# Altium schematic sheet eGAN-FET-module_Driver.SchDoc
size 594 x 420 mm; SheetNumber: 4; Format: A2
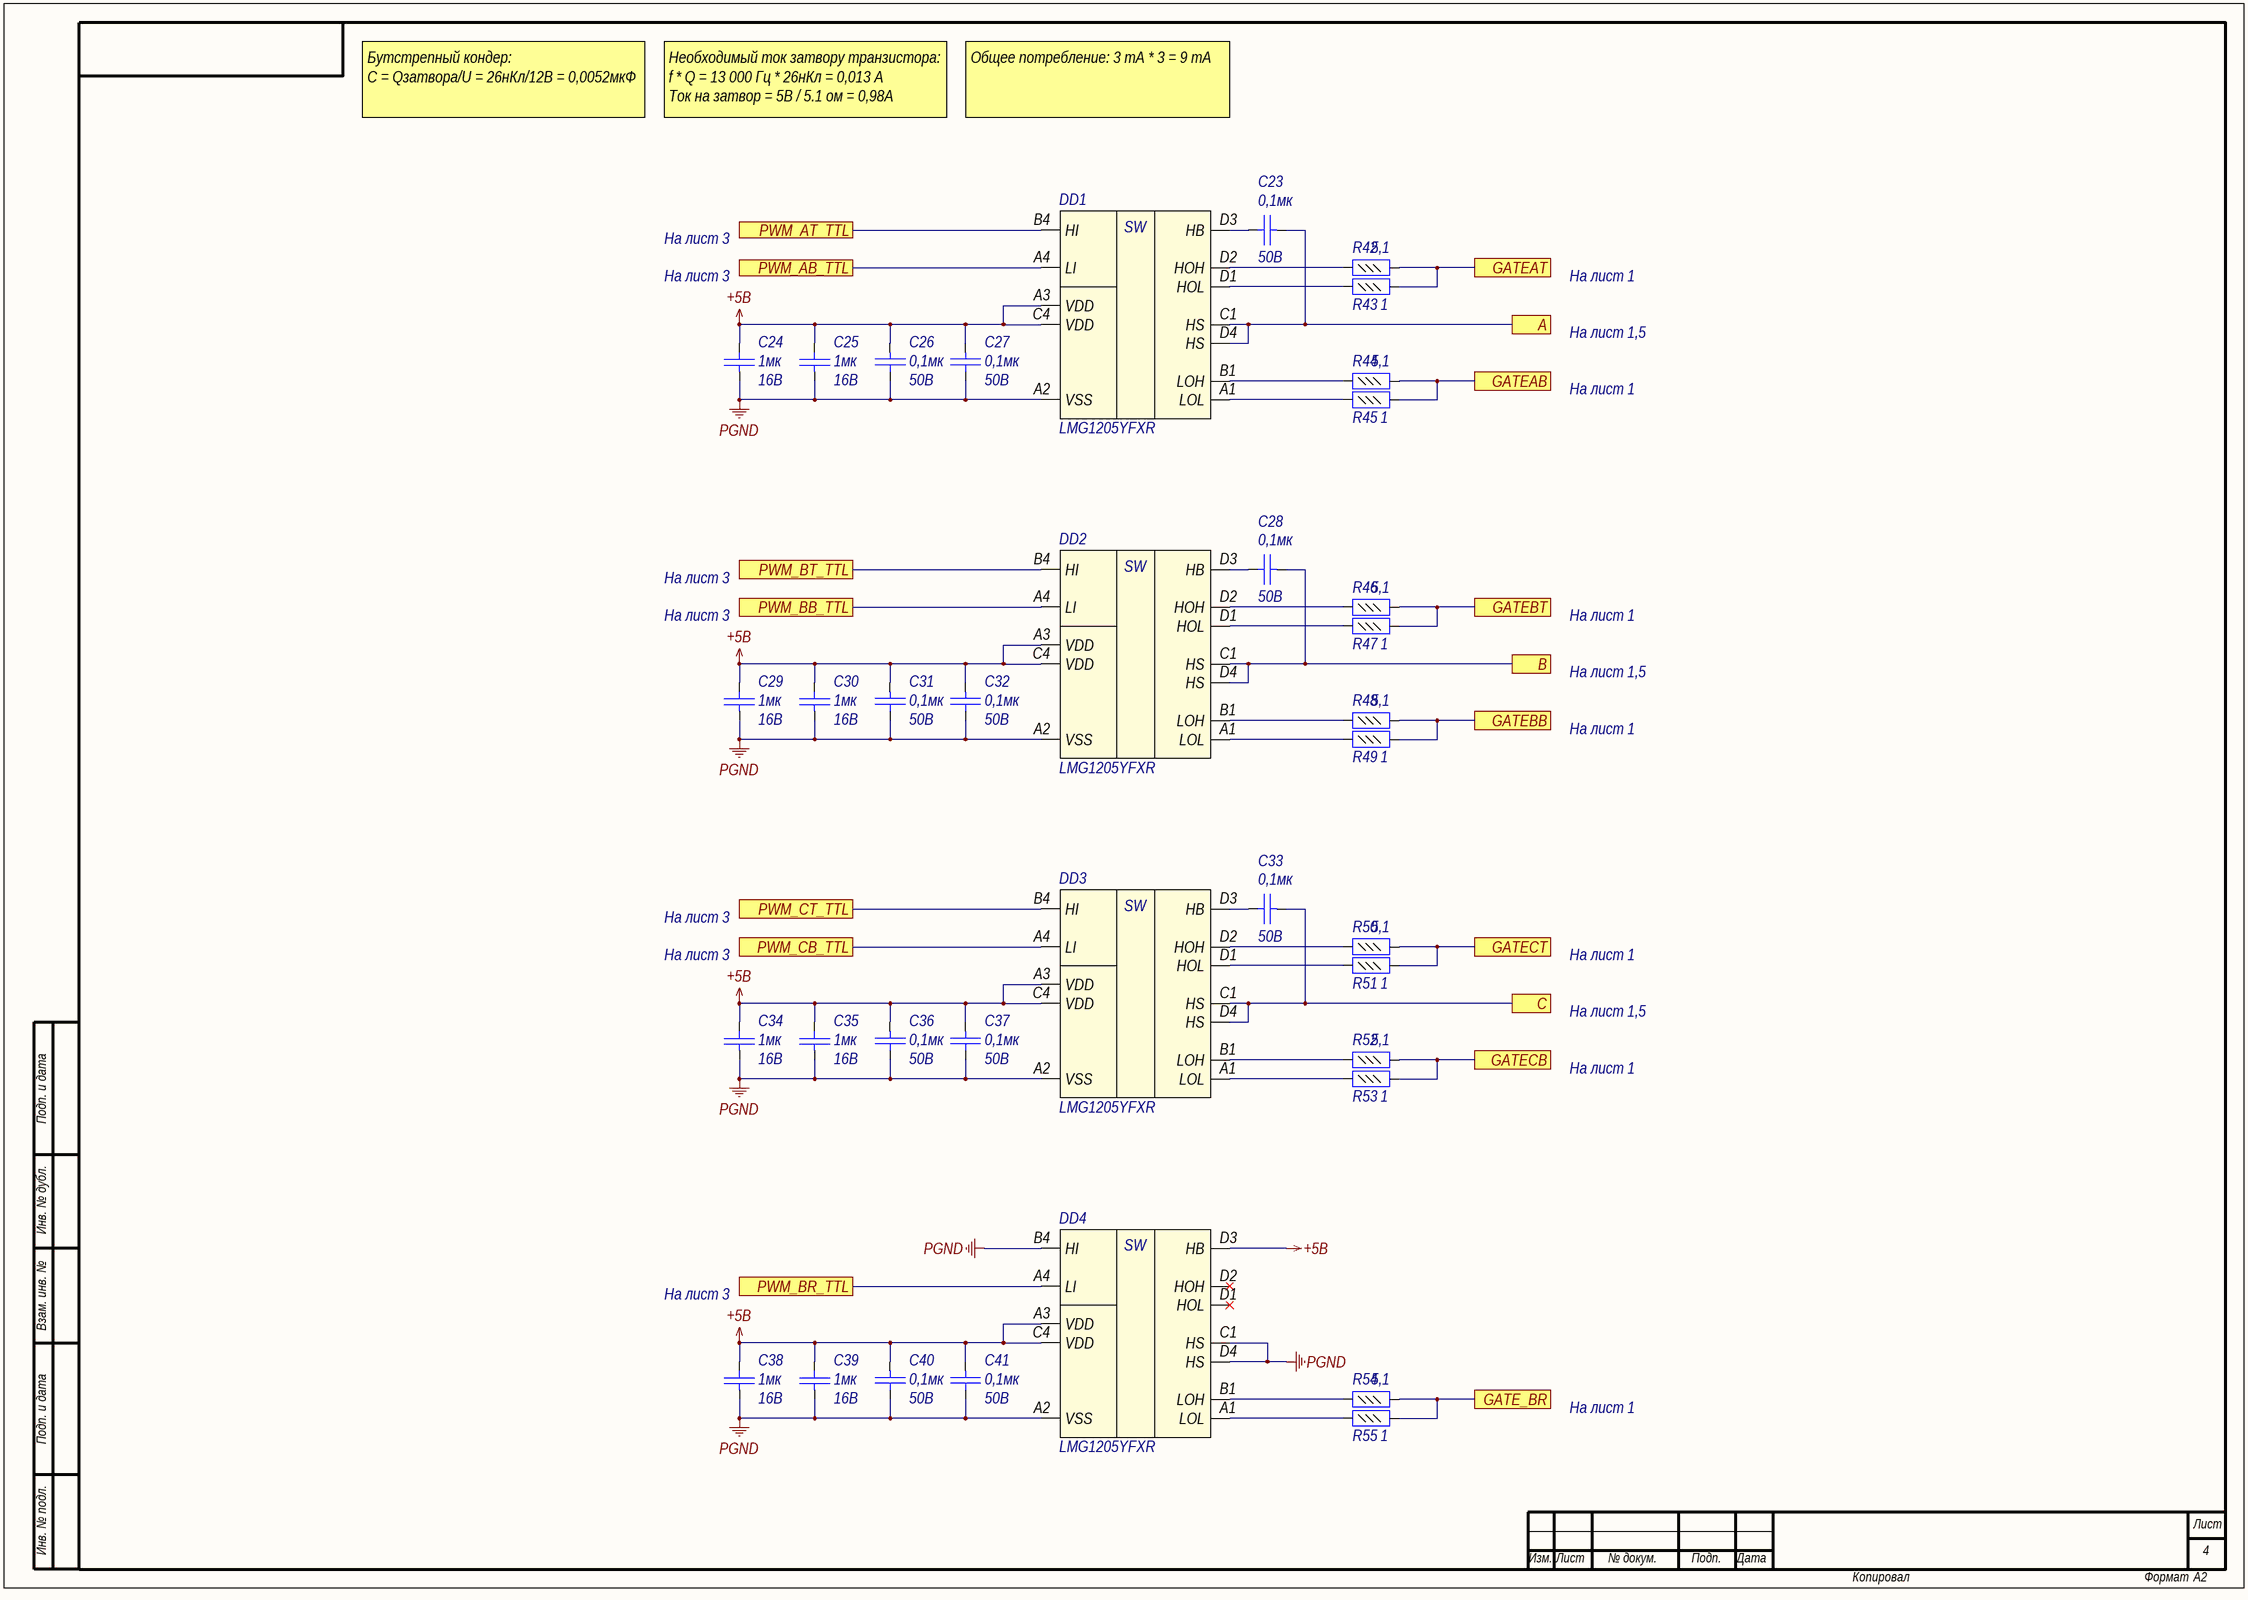
[diagram p0: eGAN-FET-module_Driver.SchDoc]

## Parts
C23  value 0,1мк  Voltage: 50В  [C0402]  (hidden comment: Capacitor)
C24  Voltage: 16B  [C0402]  (hidden comment: 1мк)
C25  Voltage: 16B  [C0402]  (hidden comment: 1мк)
C26  value 0,1мк  Voltage: 50В  [C0402]  (hidden comment: Capacitor)
C27  value 0,1мк  Voltage: 50В  [C0402]  (hidden comment: Capacitor)
C28  value 0,1мк  Voltage: 50В  [C0402]  (hidden comment: Capacitor)
C29  Voltage: 16B  [C0402]  (hidden comment: 1мк)
C30  Voltage: 16B  [C0402]  (hidden comment: 1мк)
C31  value 0,1мк  Voltage: 50В  [C0402]  (hidden comment: Capacitor)
C32  value 0,1мк  Voltage: 50В  [C0402]  (hidden comment: Capacitor)
C33  value 0,1мк  Voltage: 50В  [C0402]  (hidden comment: Capacitor)
C34  Voltage: 16B  [C0402]  (hidden comment: 1мк)
C35  Voltage: 16B  [C0402]  (hidden comment: 1мк)
C36  value 0,1мк  Voltage: 50В  [C0402]  (hidden comment: Capacitor)
C37  value 0,1мк  Voltage: 50В  [C0402]  (hidden comment: Capacitor)
C38  Voltage: 16B  [C0402]  (hidden comment: 1мк)
C39  Voltage: 16B  [C0402]  (hidden comment: 1мк)
C40  value 0,1мк  Voltage: 50В  [C0402]  (hidden comment: Capacitor)
C41  value 0,1мк  Voltage: 50В  [C0402]  (hidden comment: Capacitor)
DD1  LMG1205YFXR  [DSBGA12]
DD2  LMG1205YFXR  [DSBGA12]
DD3  LMG1205YFXR  [DSBGA12]
DD4  LMG1205YFXR  [DSBGA12]
R42  value 5,1  [R0402]  (hidden comment: Resistor_0,062Вт)
R43  value 1  [R0402]  (hidden comment: Resistor_0,062Вт)
R44  value 5,1  [R0402]  (hidden comment: Resistor_0,062Вт)
R45  value 1  [R0402]  (hidden comment: Resistor_0,062Вт)
R46  value 5,1  [R0402]  (hidden comment: Resistor_0,062Вт)
R47  value 1  [R0402]  (hidden comment: Resistor_0,062Вт)
R48  value 5,1  [R0402]  (hidden comment: Resistor_0,062Вт)
R49  value 1  [R0402]  (hidden comment: Resistor_0,062Вт)
R50  value 5,1  [R0402]  (hidden comment: Resistor_0,062Вт)
R51  value 1  [R0402]  (hidden comment: Resistor_0,062Вт)
R52  value 5,1  [R0402]  (hidden comment: Resistor_0,062Вт)
R53  value 1  [R0402]  (hidden comment: Resistor_0,062Вт)
R54  value 5,1  [R0402]  (hidden comment: Resistor_0,062Вт)
R55  value 1  [R0402]  (hidden comment: Resistor_0,062Вт)

## Ports
A, B, C, GATE_BR, GATEAB, GATEAT, GATEBB, GATEBT, GATECB, GATECT, PWM_AB_TTL, PWM_AT_TTL, PWM_BB_TTL, PWM_BR_TTL, PWM_BT_TTL, PWM_CB_TTL, PWM_CT_TTL

## Nets
+5B: C24.2 C25.2 C26.1 C27.1 C29.2 C30.2 C31.1 C32.1 C34.2 C35.2 C36.1 C37.1 C38.2 C39.2 C40.1 C41.1 DD1.A3(VDD) DD1.C4(VDD) DD2.A3(VDD) DD2.C4(VDD) DD3.A3(VDD) DD3.C4(VDD) DD4.A3(VDD) DD4.C4(VDD) DD4.D3(HB)
PGND: C24.1 C25.1 C26.2 C27.2 C29.1 C30.1 C31.2 C32.2 C34.1 C35.1 C36.2 C37.2 C38.1 C39.1 C40.2 C41.2 DD1.A2(VSS) DD2.A2(VSS) DD3.A2(VSS) DD4.A2(VSS) DD4.B4(HI) DD4.C1(HS) DD4.D4(HS)
A: C23.1 DD1.C1(HS) DD1.D4(HS) ; port A
B: C28.1 DD2.C1(HS) DD2.D4(HS) ; port B
C: C33.1 DD3.C1(HS) DD3.D4(HS) ; port C
GATE_BR: R54.2 R55.2 ; port GATE_BR
GATEAB: R44.2 R45.2 ; port GATEAB
GATEAT: R42.2 R43.2 ; port GATEAT
GATEBB: R48.2 R49.2 ; port GATEBB
GATEBT: R46.2 R47.2 ; port GATEBT
GATECB: R52.2 R53.2 ; port GATECB
GATECT: R50.2 R51.2 ; port GATECT
PWM_AB_TTL: DD1.A4(LI) ; port PWM_AB_TTL
PWM_AT_TTL: DD1.B4(HI) ; port PWM_AT_TTL
PWM_BB_TTL: DD2.A4(LI) ; port PWM_BB_TTL
PWM_BR_TTL: DD4.A4(LI) ; port PWM_BR_TTL
PWM_BT_TTL: DD2.B4(HI) ; port PWM_BT_TTL
PWM_CB_TTL: DD3.A4(LI) ; port PWM_CB_TTL
PWM_CT_TTL: DD3.B4(HI) ; port PWM_CT_TTL
NetC23_2: C23.2 DD1.D3(HB)
NetC28_2: C28.2 DD2.D3(HB)
NetC33_2: C33.2 DD3.D3(HB)
NetDD1_A1: DD1.A1(LOL) R45.1
NetDD1_B1: DD1.B1(LOH) R44.1
NetDD1_D1: DD1.D1(HOL) R43.1
NetDD1_D2: DD1.D2(HOH) R42.1
NetDD2_A1: DD2.A1(LOL) R49.1
NetDD2_B1: DD2.B1(LOH) R48.1
NetDD2_D1: DD2.D1(HOL) R47.1
NetDD2_D2: DD2.D2(HOH) R46.1
NetDD3_A1: DD3.A1(LOL) R53.1
NetDD3_B1: DD3.B1(LOH) R52.1
NetDD3_D1: DD3.D1(HOL) R51.1
NetDD3_D2: DD3.D2(HOH) R50.1
NetDD4_A1: DD4.A1(LOL) R55.1
NetDD4_B1: DD4.B1(LOH) R54.1

Not connected (* = marked no-connect by the designer): DD4 D1(HOL)* D2(HOH)*

## Notes on the sheet
- Бутстрепный кондер:
  C = Qзатвора/U = 26нКл/12В = 0,0052мкФ
- Необходимый ток затвору транзистора:
  f * Q = 13 000 Гц * 26нКл = 0,013 А
  Ток на затвор = 5В / 5.1 ом = 0,98А
- Общее потребление: 3 mA * 3 = 9 mA
- На лист 3
- На лист 1
- На лист 1,5
- Подп. и дата
- Инв. № дубл.
- Взам. инв. №
- Инв. № подл.
- Лист
- Изм.
- № докум.
- Подп.
- Дата
- Копировал
- Формат
- (in symbol driver35) SW

## Library data of the parts
C23 C26-C28 C31-C33 C36 C37 C40 C41 = cap277: Конденсатор; Part Name: Ceramic; Manufacture: Murata; Part Number: GRM155R71H104KE14D; id: cap277; TKE: X7R; tga: 0,10%
C24 C25 C29 C30 C34 C35 C38 C39 = cap358: Конденсатор; Part Name: MLCC; Manufacture: Taiyo Yuden; Part Number: EMK105BJ105KV-F; id: cap358; TKE: X5R; tga: 0.10%; Value: 1мк; Temperature: -55°C…+85°C
DD1-DD4 = driver35: 80-V, 1.2-A to 5-A, Half Bridge GaN Driver with Integrated Bootstrap Diode; Manufacture: Texas Instruments; Min Operating Supply Voltage: 4,5B; Max Operating Supply Voltage: 5,5B; Vbus: 90B; “A” OUTPUT: Noninverting; Supply Current: 3mA; Quiescent current: 0,12mA; Maximum output current: 1,2A source; 5A sink.; id: driver35; Part Name: Half Bridge GaN Driver with Integrated Bootstrap Diode; “B” OUTPUT: Noninverting; Part Number: LMG1205YFXR
R42 R44 R46 R48 R50 R52 R54 = res215: Резистор; Manufacture: Yageo; Part Number: RC0402FR-075R1L; id: res215; Accuracy: 0.01; Part Name: Resistor; Power: 0,062Вт
R43 R45 R47 R49 R51 R53 R55 = res198: Резистор; Manufacture: Yageo; Part Number: RC0402FR-071RL; id: res198; Accuracy: 0.01; Part Name: Resistor; Power: 0,062Вт